# EAGLE design PS2USB (EAGLE 5.11)
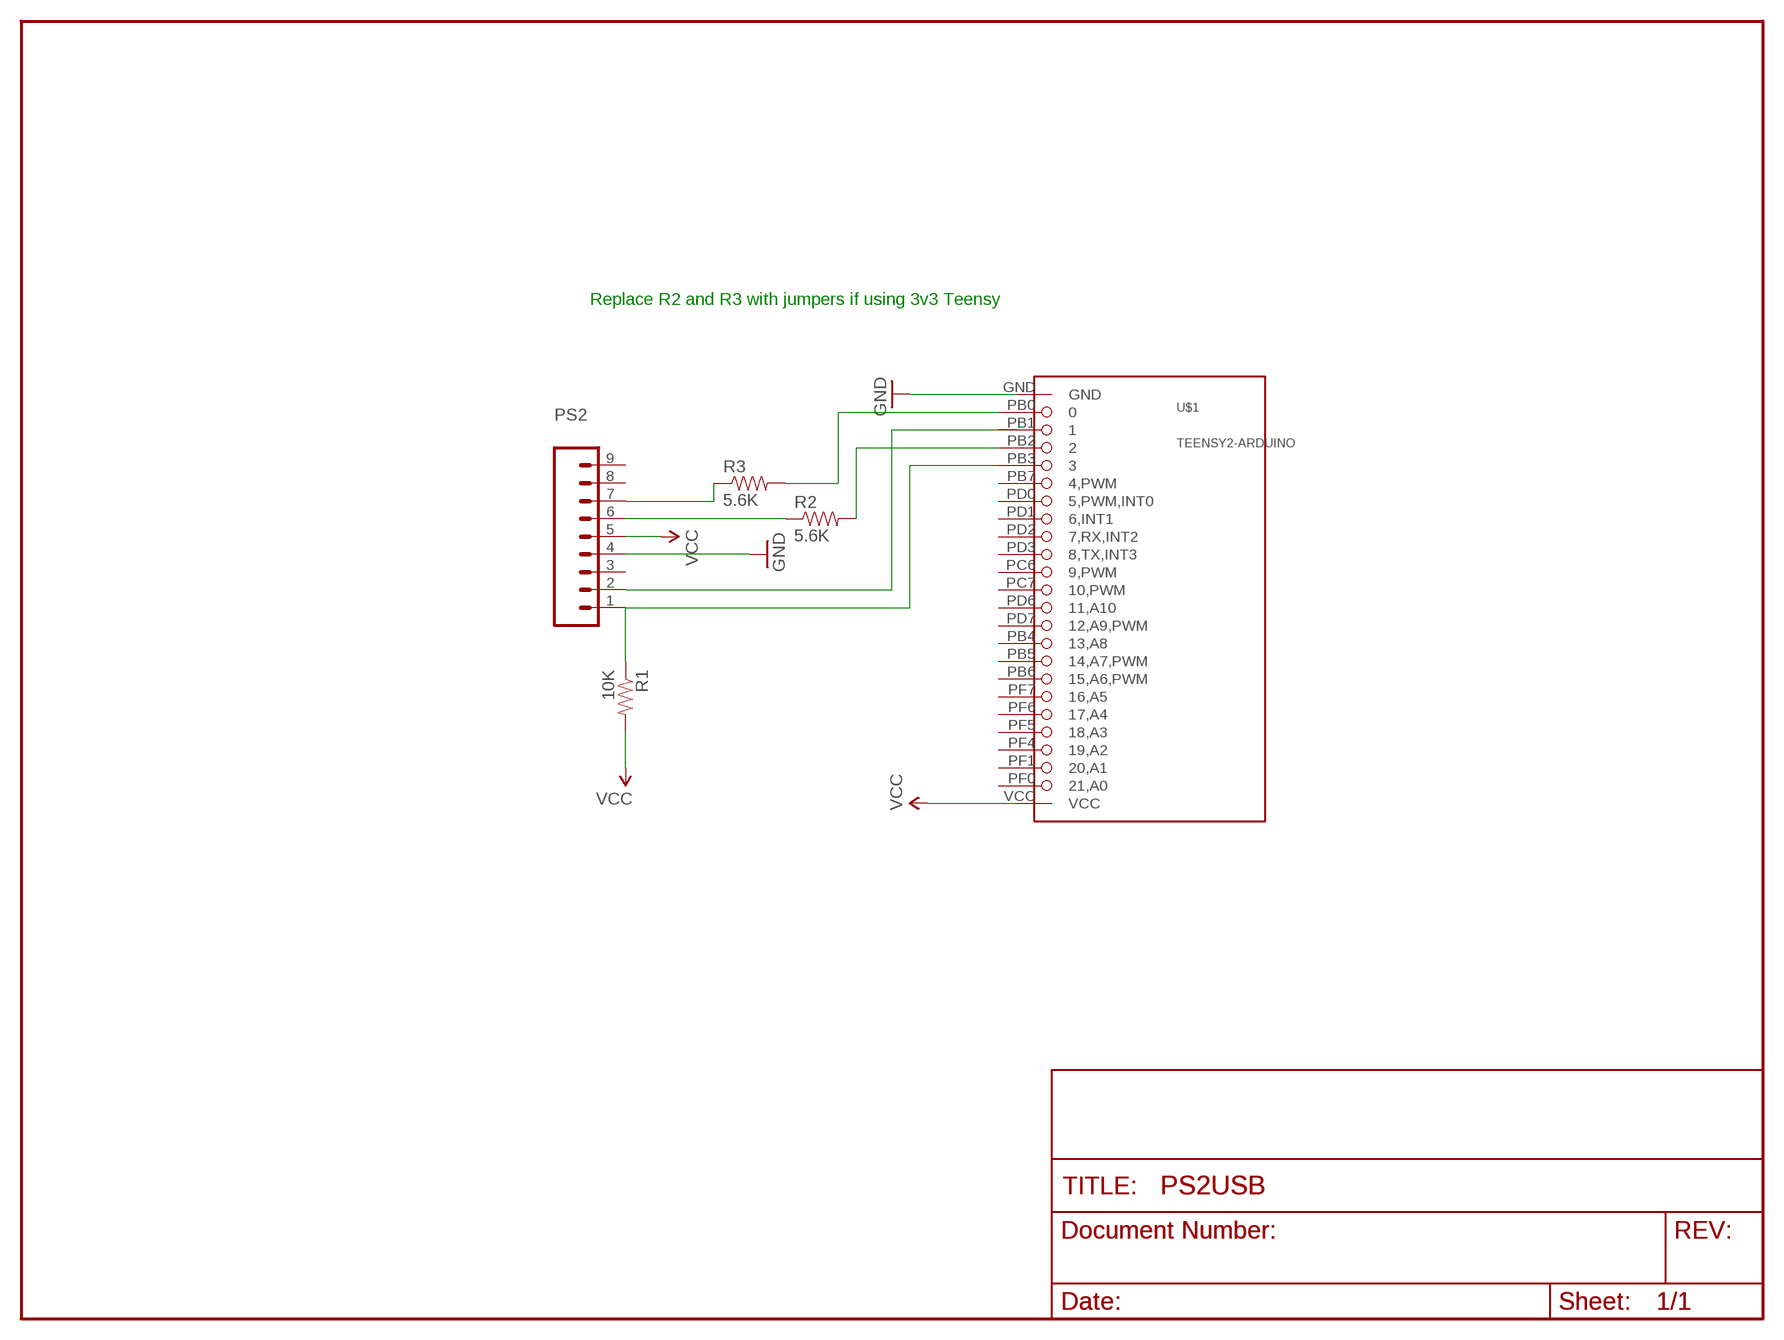
[diagram p0: schematic, sheet 1]

## Parts
PS2  M09LOCK  [1X09_LOCK]
R1  10K  RESISTORAXIAL-0.3  [AXIAL-0.3]
R2  5.6K  RESISTORAXIAL-0.3  [AXIAL-0.3]
R3  5.6K  RESISTORAXIAL-0.3  [AXIAL-0.3]
U$1  TEENSY2-ARDUINO  [TEENSY2]

## Nets
GND: PS2.4 U$1.GND
N$1: PS2.1 R1.P$1 U$1.PB3
N$2: PS2.2 U$1.PB1
N$3: PS2.6 R2.P$1
N$4: PS2.7 R3.P$1
N$5: R2.P$2 U$1.PB2
N$6: R3.P$2 U$1.PB0
VCC: PS2.5 R1.P$2 U$1.VCC
Unconnected: PS2.3 PS2.8 PS2.9 U$1.PB4(13,A8) U$1.PB5(14,A7,PWM) U$1.PB6(15,A6,PWM) U$1.PB7(4,PWM) U$1.PC6(9,PWM) U$1.PC7(10,PWM) U$1.PD0(5,PWM,INT0) U$1.PD1(6,INT1) U$1.PD2(7,RX,INT2) U$1.PD3(8,TX,INT3) U$1.PD6(11,A10) U$1.PD7(12,A9,PWM) U$1.PF0(21,A0) U$1.PF1(20,A1) U$1.PF4(19,A2) U$1.PF5(18,A3) U$1.PF6(17,A4) U$1.PF7(16,A5)

## Notes on the sheet
- Replace R2 and R3 with jumpers if using 3v3 Teensy

## Library data of the parts
PS2 = SparkFun:M09: Header 9 Standard 9-pin 0.1" header. Use with straight break away headers (SKU : PRT-00116), right angle break away headers (PRT-00553), swiss pins (PRT-00743), machine pins (PRT-00117), and female headers (PRT-00115).
R1-R3 = SparkFun:RESISTOR: Resistor Basic schematic elements and footprints for 0603, 1206, and PTH resistors.
U$1 = teensy2:TEENSY2-ARDUINO

## Board
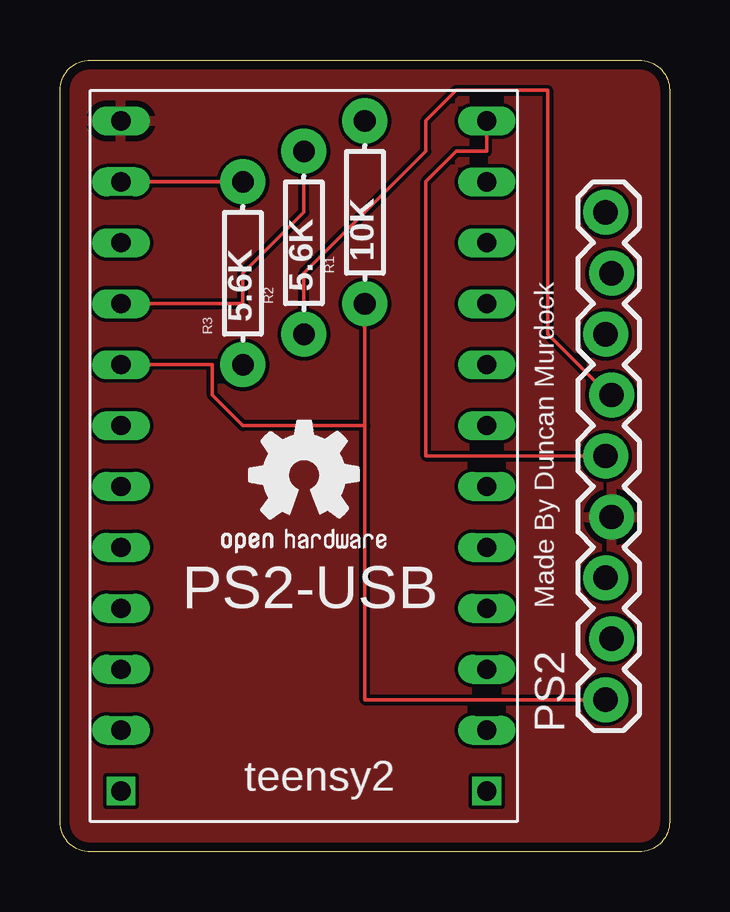
[diagram p1: board, top side]
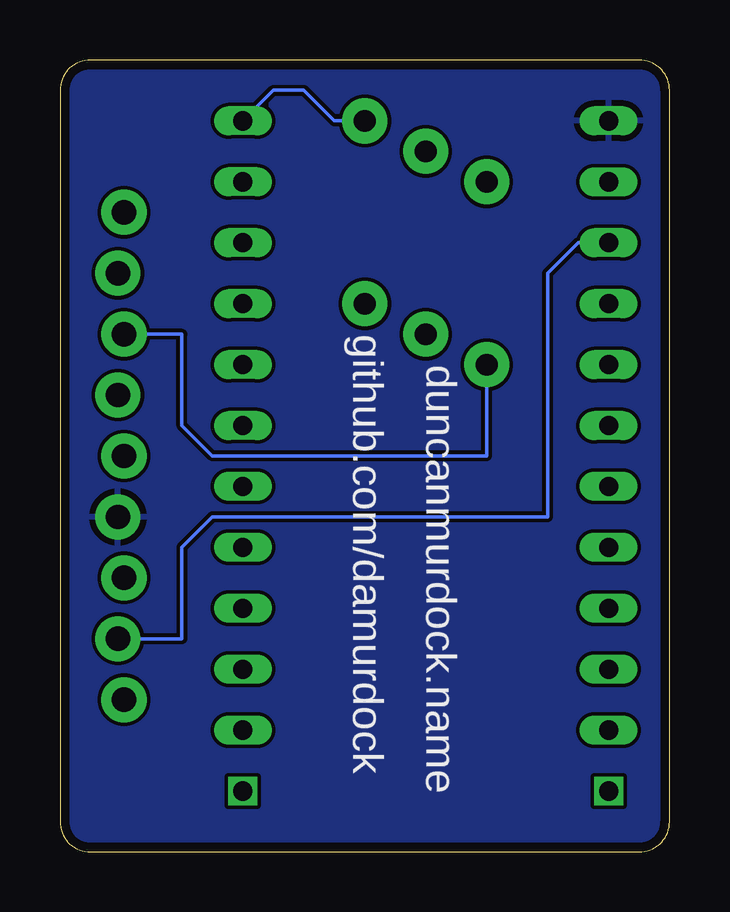
[diagram p2: board, bottom side, seen from below]

Size 25.4 x 33.02 mm. Coordinates in mm from the lower left corner, seen from the top.
Outline: 0,1.27 0,31.75 arc-90 1.27,33.02 24.13,33.02 arc-90 25.4,31.75 25.4,1.27 arc-90 24.13,0 1.27,0 arc-90 0,1.27
Copper layers (1*16): Top 0.0356mm / dielectric 1.5011mm / Bottom 0.0356mm
Design rules "LaenPCBOrder": minimum track width 6mil, minimum drill 13mil, track to track 6mil, track to pad 6mil, pad to pad 6mil, via to via 6mil, smd to smd 6mil, copper to edge 15mil, drill to drill 6mil, minimum pad ring 7mil, minimum via ring 7mil, stop-mask expansion 4mil, vias tented up to drill 0mil, thermal gap 10mil

### Footprints (pad centres in the part's own frame; a part is rotated, then mirrored left to right if it is on the bottom)
1X09_LOCK = drill 1.016 pad 1.88 round: 1 0,0.127; 2 2.54,-0.127; 3 5.08,0.127; 4 7.62,-0.127; 5 10.16,0.127; 6 12.7,-0.127; 7 15.24,0.127; 8 17.78,-0.127; 9 20.32,0.127
AXIAL-0.3 = drill 0.9 pad 1.88 round: P$1 -3.81,0; P$2 3.81,0
TEENSY2 = drill 0.8 long: GND -7.62,21.59; PB0 -7.62,19.05; PB1 -7.62,16.51; PB2 -7.62,13.97; PB3 -7.62,11.43; PB4 7.62,-1.27; PB5 7.62,1.27; PB6 7.62,3.81; PB7 -7.62,8.89; PC6 -7.62,-3.81; PD0 -7.62,6.35; PD1 -7.62,3.81; PD2 -7.62,1.27; PD3 -7.62,-1.27; PD7 7.62,-3.81; PF0 7.62,19.05; PF1 7.62,16.51; PF4 7.62,13.97; PF5 7.62,11.43; PF6 7.62,8.89; PF7 7.62,6.35; VCC 7.62,21.59 | drill 0.8 square: PC7 -7.62,-6.35; PD6 7.62,-6.35

### Placement (x,y rotation side)
PS2  22.86,6.35 90 top
R1  12.7,26.67 90 top
R2  10.16,25.4 90 top
R3  7.62,24.13 90 top
U$1  10.16,8.89 0 top
U$3  [OSHW2]  6.35,11.43 0 top

### Tracks (layer width: path | path; a pad name or v marks a point on that pad's centre or on a via)
GND
  pour Top: 0,33.02 25.4,33.02 25.4,0 0,0
  pour Bottom: 0,0 25.4,0 25.4,33.02 0,33.02
N$1
  Top 0.152: U$1.PB3 6.35,20.32 6.35,19.05 7.62,17.78 12.7,17.78 | 12.7,17.78 R1.P$1 | 12.7,17.78 12.7,6.35 PS2.1 22.86,6.35
N$2
  Bottom 0.152: U$1.PB1 3.81,25.4 5.08,24.13 5.08,13.97 19.05,13.97 20.32,12.7 20.32,8.89 PS2.2
N$3
  Top 0.152: R2.P$1 10.16,24.13 15.24,29.21 15.24,30.48 16.51,31.75 20.32,31.75 20.32,21.59 22.86,19.05 PS2.6
N$4
  Bottom 0.152: R3.P$1 7.62,16.51 19.05,16.51 20.32,17.78 20.32,21.59 PS2.7 22.86,21.59
N$5
  Top 0.152: U$1.PB2 7.62,22.86 7.62,24.13 10.16,26.67 R2.P$2
N$6
  Top 0.152: U$1.PB0 R3.P$2
VCC
  Top 0.152: U$1.VCC 17.78,29.21 16.51,29.21 15.24,27.94 15.24,16.51 PS2.5 22.86,16.51
  Bottom 0.152: U$1.VCC 16.51,31.75 15.24,31.75 13.97,30.48 R1.P$2

### Text on the board
_tsilk: PS2-USB | Made By Duncan Murdock
_bsilk: github.com/damurdock | duncanmurdock.name